# Altium schematic sheet Power.SchDoc
size A3
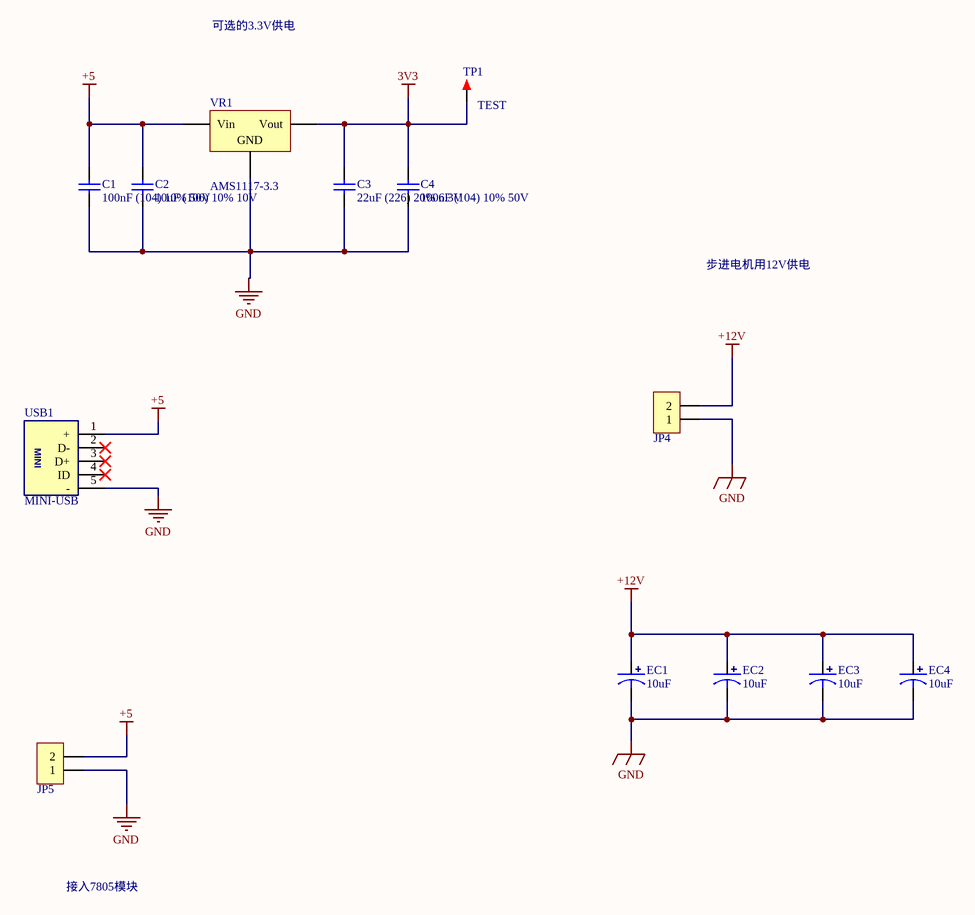
[diagram p0: Power.SchDoc]

## Parts
C1  100nF (104) 10% 50V  [0603_C]
C2  10uF (106) 10% 10V  [0603_C]
C3  22uF (226) 20% 6.3V  [0603_C]
C4  100nF (104) 10% 50V  [0603_C]
EC1  10uF  [DIP-EC1.5X4X8]
EC2  10uF  [DIP-EC1.5X4X8]
EC3  10uF  [DIP-EC1.5X4X8]
EC4  10uF  [DIP-EC1.5X4X8]
JP4  HDR-1X2  [KF7620-2P]  (value not drawn)
JP5  HDR-1X2  [KF7620-2P]  (value not drawn)
TP1  TEST  [TEST 1]
USB1  MINI-USB  [USB-MINI-A]
VR1  AMS1117-3.3  [SOT-223]

## Nets
3V3: C3.2 C4.2 TP1.1 VR1.2(Vout)
+5: C1.2 C2.2 JP5.2 USB1.1(+) VR1.3(Vin)
+12V: EC1.1 EC2.1 EC3.1 EC4.1 JP4.2
GND: C1.1 C2.1 C3.1 C4.1 EC1.2 EC2.2 EC3.2 EC4.2 JP4.1 JP5.1 USB1.5(-) VR1.1(GND)

Not connected (* = marked no-connect by the designer): USB1 2(D-)* 3(D+)* 4(ID)*

## Notes on the sheet
- 可选的3.3V供电
- 步进电机用12V供电
- 接入7805模块
- (in symbol MINI-USB) MINI

## Library data of the parts
C1 C4 = 0603 100nF (104) 10% 50V: 贴片电容; ComponentLink1Description: 供应商链接; ComponentLink1URL: http://www.szlcsc.com/product/details_15331.html; Package: 0603; Supplier: LC; SuppliersPartNumber: C14663
C2 = 0603 10uF (106) 10% 10V: 贴片电容; ComponentLink1Description: 供应商链接; ComponentLink1URL: http://www.szlcsc.com/product/details_20411.html; Package: 0603; Supplier: LC; SuppliersPartNumber: C19702
C3 = 0603 22uF (226) 20% 6.3V: 贴片电容; ComponentLink1Description: 供应商链接; ComponentLink1URL: http://www.szlcsc.com/product/details_60514.html; Package: 0603; Supplier: LC; SuppliersPartNumber: C59461
EC1-EC4 = DIP_ECAP: 直插电解电容
JP4 JP5 = Header 2: 2P接插件; 版权归属: 源创客; BOM名称: 2P接插件; 学习资源: www.ooocke.com
TP1 = TEST: 测试点; 版权归属: 源创客; BOM名称: 测试点; 学习资源: www.ooocke.com
VR1 = SOT-223 AMS1117-3.3: 低压差线性稳压(LDO); ComponentLink1Description: 供应商链接; ComponentLink1URL: http://www.szlcsc.com/product/details_6652.html; Package: SOT-223; Supplier: LC; SuppliersPartNumber: C6186